# Altium schematic sheet BUS.SchDoc
size A4
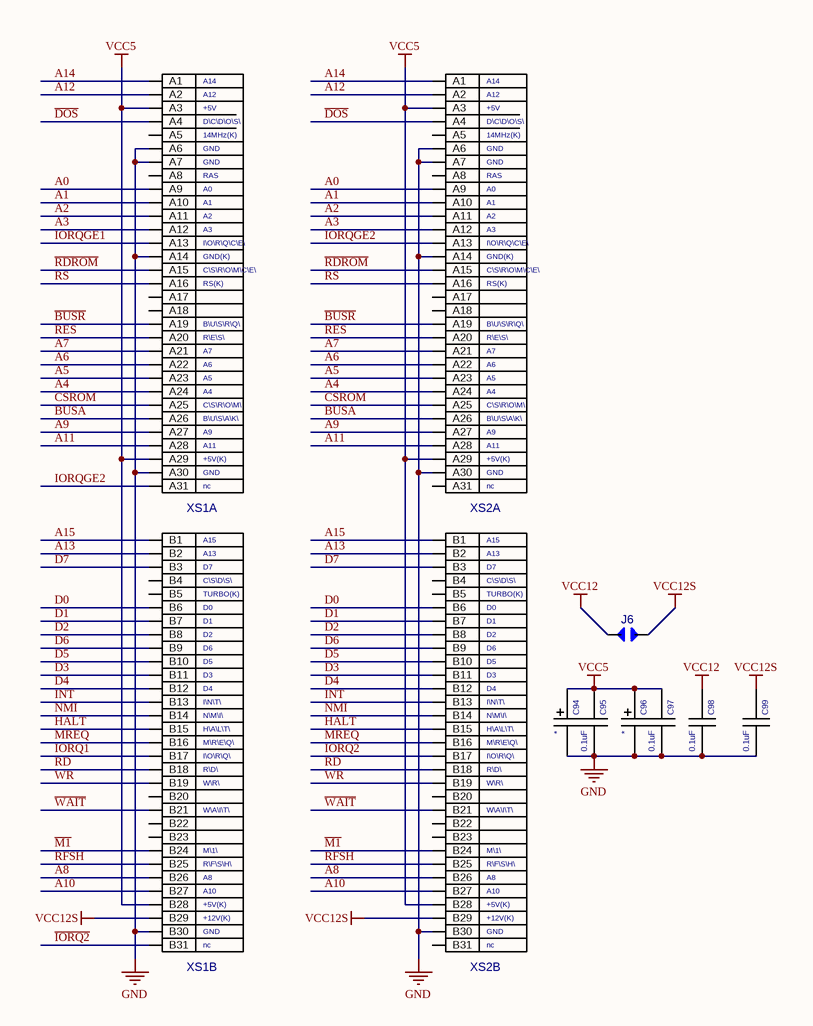
[diagram p0: BUS.SchDoc]

## Parts
C94  ECAPCHIPB  [EC-CHIPB]  (value not drawn)
C95  value 0.1uF  [C-CHIP]  (hidden comment: CAPCHIP)
C96  ECAPCHIPB  [EC-CHIPB]  (value not drawn)
C97  value 0.1uF  [C-CHIP]  (hidden comment: CAPCHIP)
C98  value 0.1uF  [C-CHIP]  (hidden comment: CAPCHIP)
C99  value 0.1uF  [C-CHIP]  (hidden comment: CAPCHIP)
J6  JUMPER  [JUMPER]  (value not drawn)
XS1  ZXSLOT  [SLOT62]  (value not drawn)  (parts A,B of 2)
XS2  ZXSLOT  [SLOT62]  (value not drawn)  (parts A,B of 2)

## Nets
GND: C94.2 C95.2 C96.2 C97.2 C98.2 C99.2 XS1.A6 XS1.A7 XS1.A14 XS1.A30 XS1.B30 XS2.A6 XS2.A7 XS2.A14 XS2.A30 XS2.B30
VCC5: C94.1 C95.1 C96.1 C97.1 XS1.A3 XS1.A29 XS1.B28 XS2.A3 XS2.A29 XS2.B28
VCC12: C98.1 J6.0
VCC12S: C99.1 J6.1 XS1.B29 XS2.B29
A0: XS1.A9 XS2.A9
A1: XS1.A10 XS2.A10
A2: XS1.A11 XS2.A11
A3: XS1.A12 XS2.A12
A4: XS1.A24 XS2.A24
A5: XS1.A23 XS2.A23
A6: XS1.A22 XS2.A22
A7: XS1.A21 XS2.A21
A8: XS1.B26 XS2.B26
A9: XS1.A27 XS2.A27
A10: XS1.B27 XS2.B27
A11: XS1.A28 XS2.A28
A12: XS1.A2 XS2.A2
A13: XS1.B2 XS2.B2
A14: XS1.A1 XS2.A1
A15: XS1.B1 XS2.B1
~{BUSA}: XS1.A26 XS2.A26
~{BUSR}: XS1.A19 XS2.A19
~{CSROM}: XS1.A25 XS2.A25
D0: XS1.B6 XS2.B6
D1: XS1.B7 XS2.B7
D2: XS1.B8 XS2.B8
D3: XS1.B11 XS2.B11
D4: XS1.B12 XS2.B12
D5: XS1.B10 XS2.B10
D6: XS1.B9 XS2.B9
D7: XS1.B3 XS2.B3
~{DOS}: XS1.A4 XS2.A4
~{HALT}: XS1.B15 XS2.B15
~{INT}: XS1.B13 XS2.B13
~{IORQ1}: XS1.B17
~{IORQ2}: XS1.B31 XS2.B17
IORQGE1: XS1.A13
IORQGE2: XS1.A31 XS2.A13
~{M1}: XS1.B24 XS2.B24
~{MREQ}: XS1.B16 XS2.B16
~{NMI}: XS1.B14 XS2.B14
~{RD}: XS1.B18 XS2.B18
~{RDROM}: XS1.A15 XS2.A15
~{RES}: XS1.A20 XS2.A20
~{RFSH}: XS1.B25 XS2.B25
RS: XS1.A16 XS2.A16
~{WAIT}: XS1.B21 XS2.B21
~{WR}: XS1.B19 XS2.B19

Not connected (* = marked no-connect by the designer): XS1 A5 A8 A17 A18 B4 B5 B20 B22 B23; XS2 A5 A8 A17 A18 A31 B4 B5 B20 B22 B23 B31

## Notes on the sheet
- (in symbol ZXSLOT, part A) +5V; D\C\D\O\S\; 14MHz(K); GND; RAS; A0; I\O\R\Q\C\E\; GND(K); C\S\R\O\M\C\E\; RS(K); B\U\S\R\Q\; R\E\S\; C\S\R\O\M\; B\U\S\A\K\; +5V(K); nc
- (in symbol ZXSLOT, part B) D7; C\S\D\S\; TURBO(K); D0; D1; D2; D6; D5; D3; D4; I\N\T\; N\M\I\; H\A\L\T\; M\R\E\Q\; I\O\R\Q\; R\D\; W\R\; W\A\I\T\; M\1\; R\F\S\H\; +5V(K); +12V(K); GND; nc

## Library data of the parts
J6 = JUMPER: 12V enabled; Value: *
C94 C96 = ECAPCHIPB: Value: *
XS1 XS2 = ZXSLOT: Value: *